# Altium project PiezoDrive DIP Board.PrjPCB
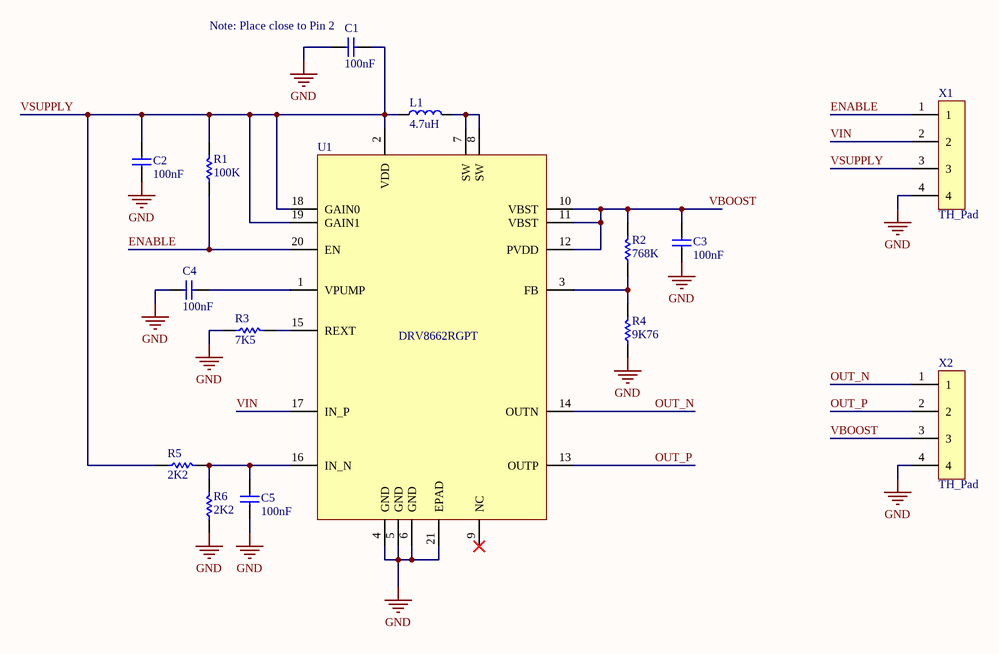
[diagram p0: Schematic.SchDoc]
1 sheet, 15 parts. Net scope: global (net labels, ports and power ports of the same name join across sheets).
Board file: PCB.PcbDoc

## Sheet Schematic.SchDoc: DRV8662 Breakout Board
size A4; DocumentNumber: 1; Revision: 1.0; SheetNumber: 1; SheetTotal: 1

### Parts
C1  100nF  [CAP 0603/1608]
C2  100nF  [CAP 0603/1608]
C3  100nF  [CAP 1206/3216]
C4  100nF  [CAP 0603/1608]
C5  100nF  [CAP 0603/1608]
L1  4.7uH  [COILCRAFT_LPS4018]
R1  100K  [RES 0603/1608]
R2  768K  [RES 0603/1608]
R3  7K5  [RES 0603/1608]
R4  9K76  [RES 0603/1608]
R5  2K2  [RES 0603/1608]
R6  2K2  [RES 0603/1608]
U1  DRV8662RGPT  [QFN-20 4x4MM]
X1  TH_Pad  [1X4 TH_PAD]
X2  TH_Pad  [1X4 TH_PAD]

### Nets
GND: C1.1 C2.1 C3.1 C4.2 C5.2 R3.1 R4.1 R6.1 U1.4(GND) U1.5(GND) U1.6(GND) U1.21(EPAD) X1.4 X2.4
ENABLE: R1.1 U1.20(EN) X1.1
OUT_N: U1.14(OUTN) X2.1
OUT_P: U1.13(OUTP) X2.2
VBOOST: C3.2 R2.2 U1.10(VBST) U1.11(VBST) U1.12(PVDD) X2.3
VIN: U1.17(IN_P) X1.2
VSUPPLY: C1.2 C2.2 L1.1 R1.2 R5.1 U1.2(VDD) U1.18(GAIN0) U1.19(GAIN1) X1.3
NetC4_1: C4.1 U1.1(VPUMP)
NetC5_1: C5.1 R5.2 R6.2 U1.16(IN_N)
NetL1_2: L1.2 U1.7(SW) U1.8(SW)
NetR2_1: R2.1 R4.2 U1.3(FB)
NetR3_2: R3.2 U1.15(REXT)

Not connected (* = marked no-connect by the designer): U1 9(NC)*

### Notes on the sheet
- (near C1) Note: Place close to Pin 2
- Title:
- Size:
- Date:
- A4
- Revision:
- Sheet
- of
- File:

### Library data of the parts
C1 C2 C4 C5 = CGA3E2X7R1E104K080AA: CAPACITOR 0603 100nF 25V 10%; Manufacturer: TDK; Dielectric: X7R; Supplier 1: Farnell; Manufacturer Part Number: CGA3E2X7R1E104K080AA; Stock 1: 0; Mount: Surface Mount; Case/Package: 0603; Weight: 7.1E-05oz; Case Code (Metric): 1608; Case Code (Imperial): 0603; Min Operating Temperature: -55°C; Max Operating Temperature: 125°C; Packaging: Tape and Reel; Capacitance: 100nF; Tolerance: 10%; Voltage Rating: 25V; Termination: SMD/SMT; Package Quantity: 1; Voltage Rating (DC): 25V; Resistor Type: Ceramic; Length: 1.6mm; Height: 0.8mm; Depth: 0.8mm; Width: 0.031inch; Thickness: 0.035inch; Ratings: AEC-Q200; Lead Free: Lead Free; REACH SVHC: No SVHC; ComponentLink1URL: http://www.farnell.com/datasheets/1735392.pdf?src-supplier=Element14; ComponentLink1Description: http://www.farnell.com/datasheets/1735392.pdf?src-supplier=Element14; ComponentLink2URL: https://product.tdk.com/info/en/documents/chara_sheet/CGA3E2X7R1E104K080AA.pdf?src-supplier=Mouser; ComponentLink2Description: https://product.tdk.com/info/en/documents/chara_sheet/CGA3E2X7R1E104K080AA.pdf?src-supplier=Mouser; ComponentLink3URL: http://product.tdk.com/capacitor/mlcc/en/documents/mlccspec_automotive_general_midvoltage_en.pdf?src-supplier=Future+Electronics; ComponentLink3Description: http://product.tdk.com/capacitor/mlcc/en/documents/mlccspec_automotive_general_midvoltage_en.pdf?src-supplier=Future+Electronics; ComponentLink4URL: http://www.farnell.com/datasheets/1735392.pdf?src-supplier=Newark; ComponentLink4Description: http://www.farnell.com/datasheets/1735392.pdf?src-supplier=Newark
C3 = GRM31CR72E104KW03L: CAPACITOR 1206 100nF 250V X7R 10%; Manufacturer: Murata; Material: Ceramic; Dissipation Factor: 0.025%; Insulation Resistance: 10GR; Supplier 1: Farnell; Manufacturer Part Number: GRM31CR72E104KW03L; Stock 1: 0; Pricing 1: 150=0.332, 250=0.321, 500=0.257, 1000=0.193, 2000=0.154, 10000=0.129 (EUR); Mount: Surface Mount; Case/Package: 1206; Number of Pins: 2; Weight: 0.000571oz; Case Code (Metric): 3216; Case Code (Imperial): 1206; Min Operating Temperature: -55°C; Max Operating Temperature: 125°C; Capacitance: 100nF; Tolerance: 10%; Dielectric: X7R; Package Quantity: 1; Voltage Rating: 250V; Packaging: Tape and Reel; Voltage Rating (DC): 250V; Termination: SMD/SMT; Voltage: 250V; Length: 3.2mm; Height: 1.6mm; Width: 1.6mm; Thickness: 0.071inch; Depth: 1.6mm; Radiation Hardening: No; REACH SVHC: No SVHC; Lead Free: Lead Free; ComponentLink1URL: http://search.murata.co.jp/Ceramy/image/img/A01X/G101/ENG/GRM31CR72E104KW03-01.pdf?src-supplier=Digi-Key; ComponentLink1Description: http://search.murata.co.jp/Ceramy/image/img/A01X/G101/ENG/GRM31CR72E104KW03-01.pdf?src-supplier=Digi-Key; ComponentLink2URL: http://www.farnell.com/datasheets/2048642.pdf?src-supplier=Element14; ComponentLink2Description: http://www.farnell.com/datasheets/2048642.pdf?src-supplier=Element14; ComponentLink3URL: http://www.jameco.com/Jameco/Products/ProdDS/1859520.pdf?src-supplier=Jameco; ComponentLink3Description: http://www.jameco.com/Jameco/Products/ProdDS/1859520.pdf?src-supplier=Jameco; ComponentLink4URL: http://psearch.en.murata.com/capacitor/product/GRM31CR72E104KW03%23.pdf?src-supplier=Future+Electronics; ComponentLink4Description: http://psearch.en.murata.com/capacitor/product/GRM31CR72E104KW03%23.pdf?src-supplier=Future+Electronics; ComponentLink5URL: http://uk.rs-online.com/webdocs/1423/0900766b81423c94.pdf?src-supplier=RSComponents; ComponentLink5Description: http://uk.rs-online.com/webdocs/1423/0900766b81423c94.pdf?src-supplier=RSComponents; ComponentLink6URL: http://components.arrow.com/part/dataview/41887619S9850855N2606?src-supplier=Arrow+Electronics; ComponentLink6Description: http://components.arrow.com/part/dataview/41887619S9850855N2606?src-supplier=Arrow+Electronics
L1 = LPS4018-472MRB: INDUCTOR 4.7µH 1.3A; Manufacturer: Coilcraft; Core Material: Ferrite; Inductance Tolerance: 20%; Saturation Current: 1.9A; DC Resistance (DCR): 125mR; Shielding: Shielded; Self Resonant Frequency: 65MHz; Test Frequency: 100kHz; Supplier 1: Farnell; Manufacturer Part Number: LPS4018-472MRB; Stock 1: 0; Pricing 1: 10=1.57, 50=0.828, 100=0.742, 250=0.656, 500=0.57, 1000=0.472, 5000=0.463 (EUR); Weight: 0.003527oz; Min Operating Temperature: -40°C; Max Operating Temperature: 85°C; Packaging: Cut Tape; Inductance: 4.7uH; RMS Current (Irms): 1.3A; Termination: SMD/SMT; Tolerance: 20%; Max DC Current: 1.9A; Package Quantity: 1; Length: 4mm; Height: 1.7mm; Width: 4mm; REACH SVHC: No SVHC; ComponentLink1URL: http://www.farnell.com/datasheets/1805324.pdf?src-supplier=Element14; ComponentLink1Description: http://www.farnell.com/datasheets/1805324.pdf?src-supplier=Element14
R1 = ERJ3EKF1003V: RESISTOR 0603 100K 1%; Manufacturer: Panasonic; Temperature Coefficient: 100ppm/°C; Power Rating: 100mW; Voltage Rating: 75V; Supplier 1: Farnell; Manufacturer Part Number: ERJ3EKF1003V; Stock 1: 0; Mount: Surface Mount; Case/Package: 0603; Number of Pins: 2; Weight: 7.1E-05oz; Contact Plating: Tin; Case Code (Imperial): 0603; Case Code (Metric): 1608; Min Operating Temperature: -55°C; Max Operating Temperature: 155°C; Resistance: 100K; Tolerance: 1%; Resistor Type: Thick Film; Packaging: Tape and Reel; Package Quantity: 5000; Termination: SMD/SMT; Number of Terminations: 2; Max Power Dissipation: 100mW; Voltage Rating (DC): 75V; Features: Automotive AEC-Q200; Length: 1.6mm; Height: 0.022inch; Width: 0.8mm; Depth: 0.8mm; Radiation Hardening: No; REACH SVHC: No SVHC; Military Standard: Not; Lead Free: Lead Free; ComponentLink1URL: http://industrial.panasonic.com/www-data/pdf/AOA0000/AOA0000CE2.pdf?src-supplier=Future+Electronics; ComponentLink1Description: http://industrial.panasonic.com/www-data/pdf/AOA0000/AOA0000CE2.pdf?src-supplier=Future+Electronics; ComponentLink2URL: https://www.verical.com/server-webapp/html/getDatasheet?partID=247527&src-supplier=Verical; ComponentLink2Description: https://www.verical.com/server-webapp/html/getDatasheet?partID=247527&src-supplier=Verical; ComponentLink3URL: http://www.alliedelec.com/m/d/623f45ff1957d936ff56d46fd1c28cac.pdf?src-supplier=Allied+Electronics; ComponentLink3Description: http://www.alliedelec.com/m/d/623f45ff1957d936ff56d46fd1c28cac.pdf?src-supplier=Allied+Electronics; ComponentLink4URL: http://www.jameco.com/Jameco/Products/ProdDS/1987476.pdf?src-supplier=Jameco; ComponentLink4Description: http://www.jameco.com/Jameco/Products/ProdDS/1987476.pdf?src-supplier=Jameco
R2 = ERJ3EKF7683V: RESISTOR 0603 768K 1%; Manufacturer: Panasonic; Manufacturer Part Number: ERJ-3EKF7683V; Power Rating: 100mW; Voltage Rating: 75V; Temperature Coefficient: 100ppm/°C; Voltage Rating (DC): 50V; Supplier 1: Farnell; Stock 1: 0; Mount: Surface Mount; Case/Package: 0603; Case Code (Imperial): 0603; Case Code (Metric): 1608; Contact Plating: Tin; Min Operating Temperature: -55°C; Max Operating Temperature: 155°C; Tolerance: 1%; Package Quantity: 1; Resistance: 768K; Packaging: Tape and Reel; Termination: SMD/SMT; Resistor Type: Thick Film; Number of Terminations: 2; Max Power Dissipation: 100mW; Features: Automotive AEC-Q200; Length: 1.6mm; Height: 0.022inch; Width: 0.8mm; Depth: 0.8mm; REACH SVHC: Yes; Military Standard: Not; Lead Free: Lead Free; ComponentLink1URL: http://www.farnell.com/datasheets/1678782.pdf?src-supplier=Element14; ComponentLink1Description: http://www.farnell.com/datasheets/1678782.pdf?src-supplier=Element14; ComponentLink2URL: http://industrial.panasonic.com/www-data/pdf/AOA0000/AOA0000CE2.pdf?src-supplier=Avnet; ComponentLink2Description: http://industrial.panasonic.com/www-data/pdf/AOA0000/AOA0000CE2.pdf?src-supplier=Avnet
R3 = ERJ3EKF7501V: RESISTOR 0603 7.5K 1%; Manufacturer: Panasonic; Manufacturer Part Number: ERJ-3EKF7501V; Power Rating: 100mW; Voltage Rating: 75V; Temperature Coefficient: 100ppm/°C; Voltage Rating (DC): 50V; Supplier 1: Farnell; Stock 1: 0; Pricing 1: 150=0.0229, 500=0.0168, 1000=0.0106, 2500=0.0082, 5000=0.0065, 25000=0.006 (EUR); Mount: Surface Mount; Case/Package: 0603; Case Code (Imperial): 0603; Case Code (Metric): 1608; Contact Plating: Tin; Min Operating Temperature: -55°C; Max Operating Temperature: 155°C; Tolerance: 1%; Resistance: 7K5; Packaging: Tape and Reel; Package Quantity: 1; Resistor Type: Thick Film; Number of Terminations: 2; Termination: SMD/SMT; Max Power Dissipation: 100mW; Features: Automotive AEC-Q200; Length: 1.6mm; Height: 0.022inch; Width: 0.8mm; Depth: 0.8mm; Radiation Hardening: No; REACH SVHC: No SVHC; Military Standard: Not; Lead Free: Lead Free; ComponentLink1URL: http://www.farnell.com/datasheets/1911175.pdf?src-supplier=Farnell; ComponentLink1Description: http://www.farnell.com/datasheets/1911175.pdf?src-supplier=Farnell; ComponentLink2URL: http://www.farnell.com/datasheets/1678782.pdf?src-supplier=Element14; ComponentLink2Description: http://www.farnell.com/datasheets/1678782.pdf?src-supplier=Element14; ComponentLink3URL: http://industrial.panasonic.com/www-data/pdf/AOA0000/AOA0000CE2.pdf?src-supplier=Avnet; ComponentLink3Description: http://industrial.panasonic.com/www-data/pdf/AOA0000/AOA0000CE2.pdf?src-supplier=Avnet; ComponentLink4URL: http://www.farnell.com/datasheets/1911175.pdf?src-supplier=Element14; ComponentLink4Description: http://www.farnell.com/datasheets/1911175.pdf?src-supplier=Element14; ComponentLink5URL: http://www.farnell.com/datasheets/426256.pdf?src-supplier=Element14; ComponentLink5Description: http://www.farnell.com/datasheets/426256.pdf?src-supplier=Element14; ComponentLink6URL: https://www.alliedelec.com/m/d/623f45ff1957d936ff56d46fd1c28cac.pdf?src-supplier=Allied+Electronics; ComponentLink6Description: https://www.alliedelec.com/m/d/623f45ff1957d936ff56d46fd1c28cac.pdf?src-supplier=Allied+Electronics
R4 = ERJ3EKF9761V: RESISTOR 0603 9.76K 1%; Manufacturer: Panasonic; Manufacturer Part Number: ERJ-3EKF9761V; Temperature Coefficient: 100ppm/°C; Power Rating: 100mW; Voltage Rating: 75V; Voltage Rating (DC): 50V; Supplier 1: Farnell; Stock 1: 0; Mount: Surface Mount; Case/Package: 0603; Contact Plating: Tin; Case Code (Metric): 1608; Case Code (Imperial): 0603; Min Operating Temperature: -55°C; Max Operating Temperature: 155°C; Resistance: 9K76; Tolerance: 1%; Resistor Type: Thick Film; Packaging: Tape and Reel; Package Quantity: 1; Number of Terminations: 2; Termination: SMD/SMT; Max Power Dissipation: 100mW; Features: Automotive AEC-Q200; Length: 1.6mm; Height: 0.022inch; Width: 0.031inch; Depth: 0.8mm; Radiation Hardening: No; REACH SVHC: No SVHC; Military Standard: Not; Lead Free: Lead Free; ComponentLink1URL: http://industrial.panasonic.com/www-data/pdf/AOA0000/AOA0000CE2.pdf?src-supplier=Avnet+Europe; ComponentLink1Description: http://industrial.panasonic.com/www-data/pdf/AOA0000/AOA0000CE2.pdf?src-supplier=Avnet+Europe; ComponentLink2URL: http://www.farnell.com/datasheets/1694929.pdf?src-supplier=Element14; ComponentLink2Description: http://www.farnell.com/datasheets/1694929.pdf?src-supplier=Element14; ComponentLink3URL: http://industrial.panasonic.com/www-data/pdf/AOA0000/AOA0000CE2.pdf?src-supplier=Avnet; ComponentLink3Description: http://industrial.panasonic.com/www-data/pdf/AOA0000/AOA0000CE2.pdf?src-supplier=Avnet; ComponentLink4URL: http://www.farnell.com/datasheets/1678782.pdf?src-supplier=Element14; ComponentLink4Description: http://www.farnell.com/datasheets/1678782.pdf?src-supplier=Element14; ComponentLink5URL: https://www.alliedelec.com/m/d/623f45ff1957d936ff56d46fd1c28cac.pdf?src-supplier=Allied+Electronics; ComponentLink5Description: https://www.alliedelec.com/m/d/623f45ff1957d936ff56d46fd1c28cac.pdf?src-supplier=Allied+Electronics; ComponentLink6URL: http://www.mouser.com/ds/2/315/AOA0000CE2-37512.pdf?src-supplier=Mouser; ComponentLink6Description: http://www.mouser.com/ds/2/315/AOA0000CE2-37512.pdf?src-supplier=Mouser
R5 R6 = ERJ3EKF2201V: RESISTOR 0603 2.2K 1%; Manufacturer: Panasonic; Manufacturer Part Number: ERJ-3EKF2201V; Temperature Coefficient: 100ppm/°C; Power Rating: 100mW; Voltage Rating: 75V; Supplier 1: Farnell; Stock 1: 0; Mount: Surface Mount; Case/Package: 0603; Number of Pins: 2; Contact Plating: Tin; Case Code (Imperial): 0603; Case Code (Metric): 1608; Min Operating Temperature: -55°C; Max Operating Temperature: 155°C; Resistance: 2K2; Tolerance: 1%; Resistor Type: Thick Film; Packaging: Tape and Reel; Package Quantity: 5000; Number of Terminations: 2; Termination: SMD/SMT; Max Power Dissipation: 100mW; Voltage Rating (DC): 75V; Length: 1.6mm; Height: 0.022inch; Width: 0.8mm; Depth: 0.8mm; Radiation Hardening: No; REACH SVHC: No SVHC; Military Standard: Not; Lead Free: Lead Free; ComponentLink1URL: http://industrial.panasonic.com/www-data/pdf/AOA0000/AOA0000CE2.pdf?src-supplier=Avnet; ComponentLink1Description: http://industrial.panasonic.com/www-data/pdf/AOA0000/AOA0000CE2.pdf?src-supplier=Avnet; ComponentLink2URL: http://www.farnell.com/datasheets/1678782.pdf?src-supplier=Element14; ComponentLink2Description: http://www.farnell.com/datasheets/1678782.pdf?src-supplier=Element14; ComponentLink3URL: http://www.mouser.com/ds/2/315/AOA0000C283-1093288.pdf?src-supplier=Mouser; ComponentLink3Description: http://www.mouser.com/ds/2/315/AOA0000C283-1093288.pdf?src-supplier=Mouser; ComponentLink4URL: https://www.alliedelec.com/m/d/623f45ff1957d936ff56d46fd1c28cac.pdf?src-supplier=Allied+Electronics; ComponentLink4Description: https://www.alliedelec.com/m/d/623f45ff1957d936ff56d46fd1c28cac.pdf?src-supplier=Allied+Electronics; ComponentLink5URL: http://industrial.panasonic.com/www-data/pdf/AOA0000/AOA0000CE2.pdf?src-supplier=Element14; ComponentLink5Description: http://industrial.panasonic.com/www-data/pdf/AOA0000/AOA0000CE2.pdf?src-supplier=Element14; ComponentLink6URL: http://industrial.panasonic.com/www-data/pdf/AOA0000/AOA0000CE2.pdf?src-supplier=Avnet+Europe; ComponentLink6Description: http://industrial.panasonic.com/www-data/pdf/AOA0000/AOA0000CE2.pdf?src-supplier=Avnet+Europe; ComponentLink7URL: http://www.farnell.com/datasheets/1911175.pdf?src-supplier=Element14; ComponentLink7Description: http://www.farnell.com/datasheets/1911175.pdf?src-supplier=Element14
U1 = DRV8662RGPT: PIEZO HAPTIC DRIVER; Manufacturer: Texas Instruments; Output Voltage: 100V; Nominal Supply Current: 5mA; Output Current: 75mA; Min Supply Voltage: 3V; Max Supply Voltage: 5.5V; Interface: PWM,Analog; Min Input Voltage: 1.4V; Max Input Voltage: 750mV; Logic Function: AND GATE; Collector Emitter Voltage (VCEO): 5V; Supplier 1: Farnell; Manufacturer Part Number: DRV8662RGPT; Stock 1: 0; Case/Package: QFN; Number of Pins: 20; Contact Plating: Gold; Min Operating Temperature: -40°C; Max Operating Temperature: 70°C; Package Quantity: 250; Packaging: Tape and Reel; Quiescent Current: 5mA; Length: 4.15mm; Height: 0.95mm; Width: 4.15mm; Radiation Hardening: No; Lead Free: Lead Free; REACH SVHC: No SVHC; ComponentLink1URL: http://www.ti.com/general/docs/lit/getliterature.tsp?genericPartNumber=DRV8662&amp;&amp;fileType=pdf&src-supplier=Newark; ComponentLink1Description: http://www.ti.com/general/docs/lit/getliterature.tsp?genericPartNumber=DRV8662&amp;&amp;fileType=pdf&src-supplier=Newark; ComponentLink2URL: http://www.ti.com/lit/ds/symlink/drv8662.pdf?src-supplier=Digi-Key; ComponentLink2Description: http://www.ti.com/lit/ds/symlink/drv8662.pdf?src-supplier=Digi-Key; ComponentLink3URL: https://www.verical.com/server-webapp/html/getDatasheet?partID=522234&src-supplier=Verical; ComponentLink3Description: https://www.verical.com/server-webapp/html/getDatasheet?partID=522234&src-supplier=Verical; ComponentLink4URL: http://www.ti.com/lit/ds/symlink/drv8662.pdf?src-supplier=Avnet+Europe; ComponentLink4Description: http://www.ti.com/lit/ds/symlink/drv8662.pdf?src-supplier=Avnet+Europe; ComponentLink5URL: http://www.ti.com/general/docs/lit/getliterature.tsp?genericPartNumber=DRV8662&&fileType=pdf&src-supplier=Avnet; ComponentLink5Description: http://www.ti.com/general/docs/lit/getliterature.tsp?genericPartNumber=DRV8662&&fileType=pdf&src-supplier=Avnet
X1 X2 = TH_Pad: 1X4 2.54MM TH Pad